# Altium schematic sheet MotorDrivers.SchDoc: MotorDrivers
size A3; Revision: V1.0; Time: 2017/5/10
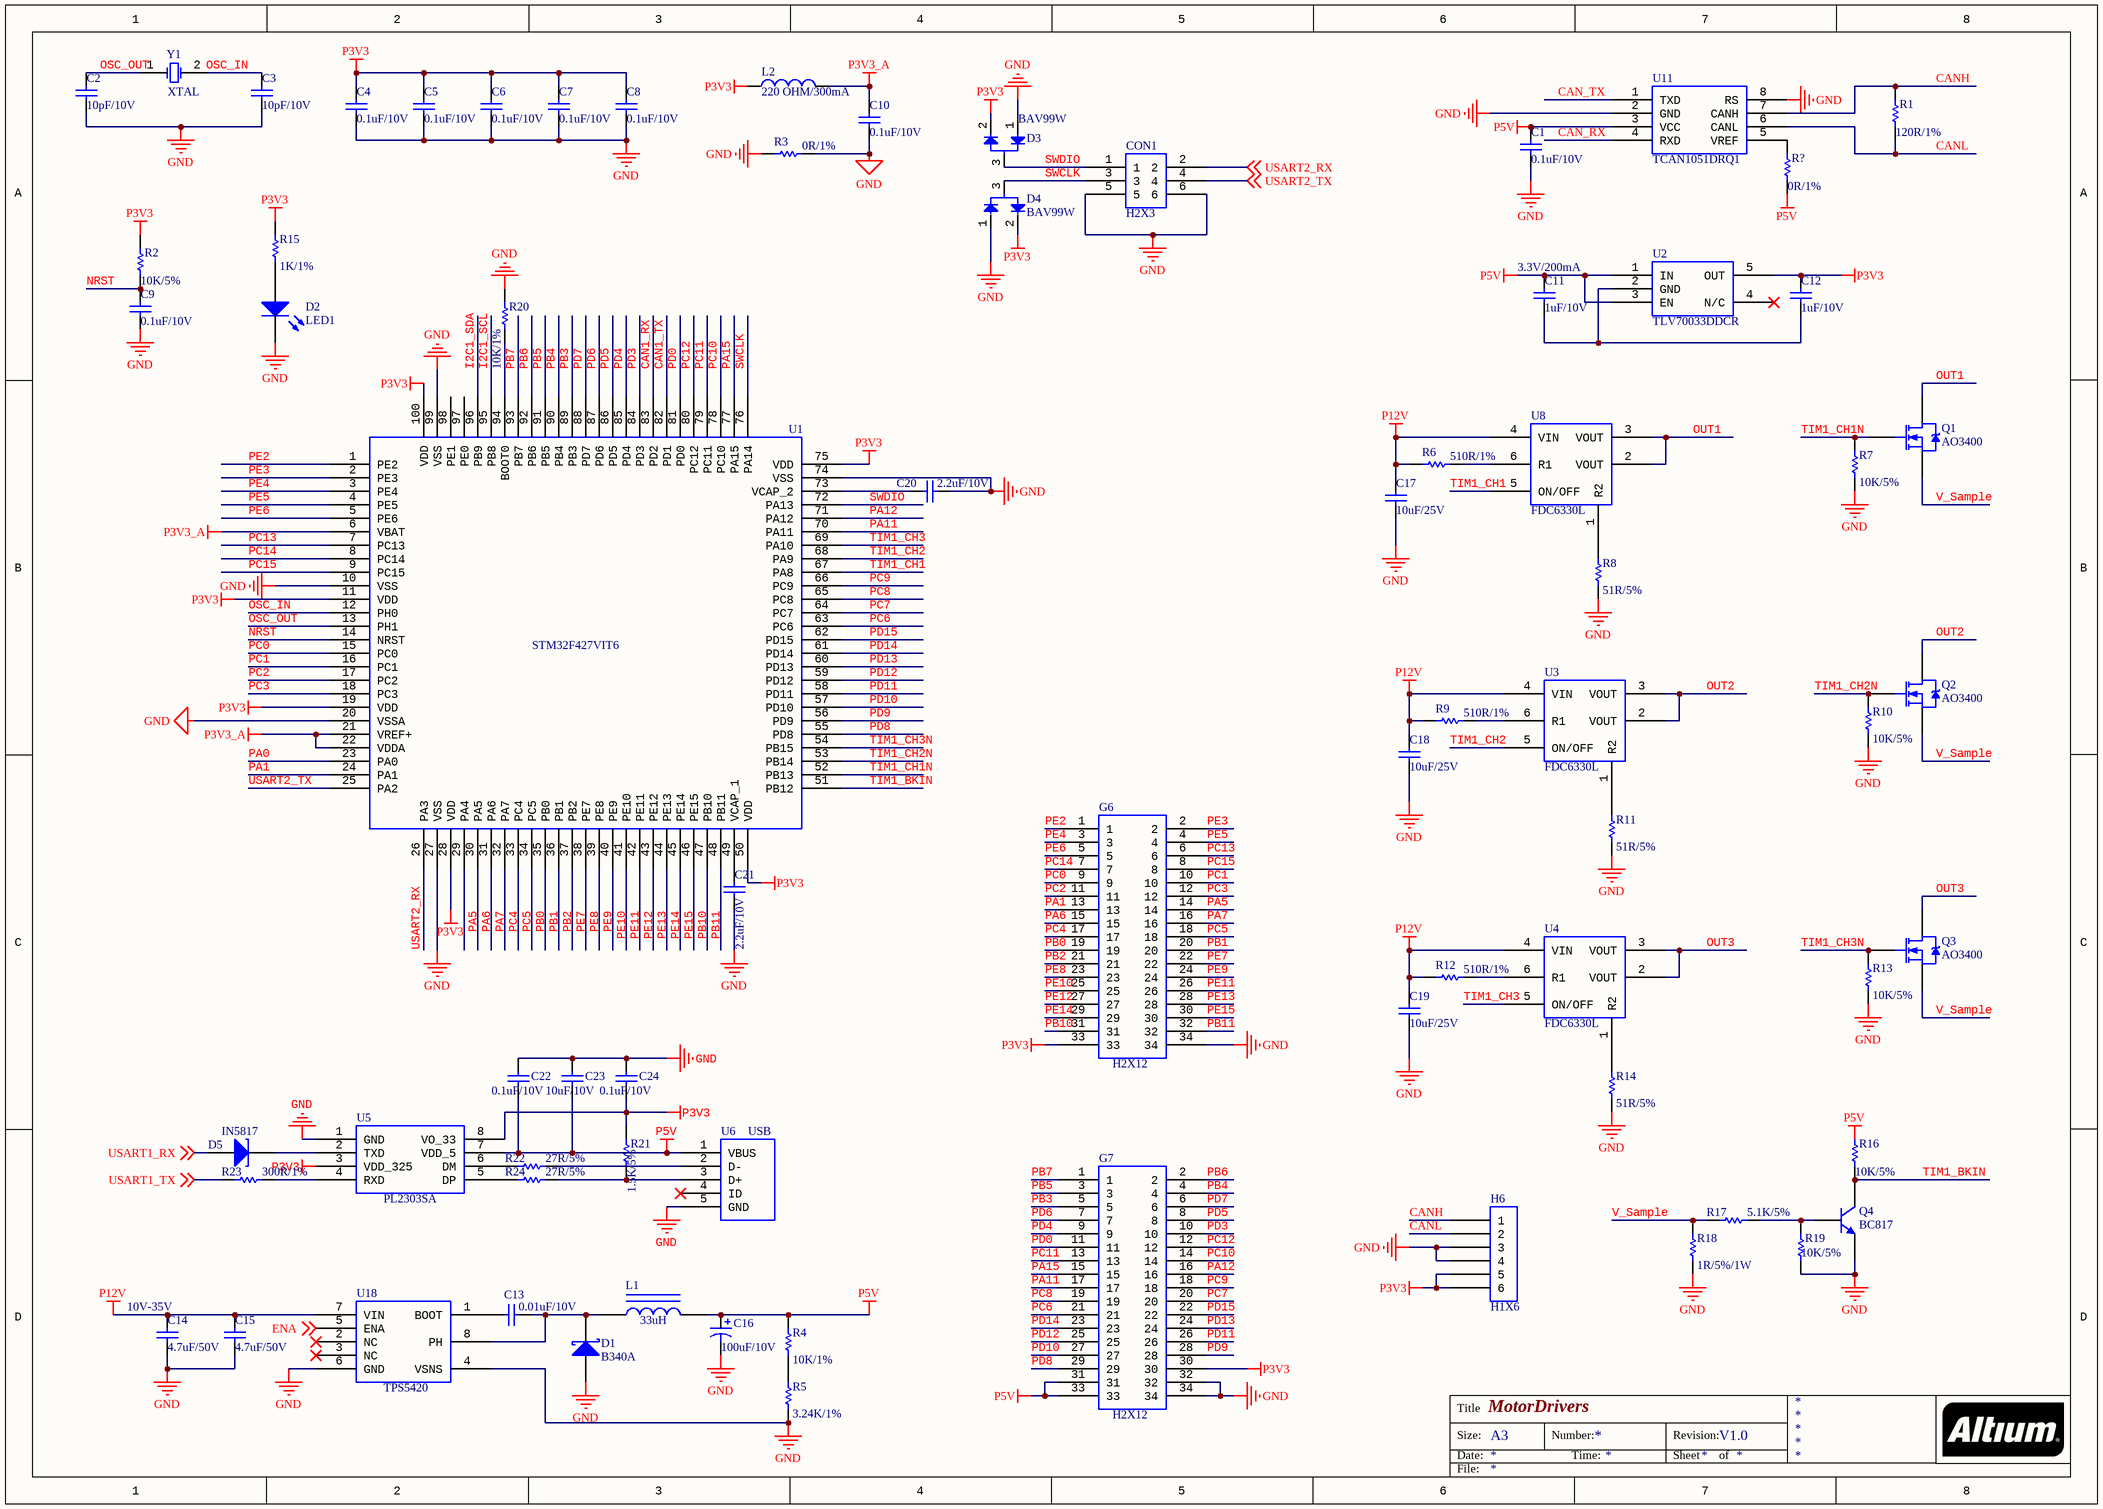
[diagram p0: MotorDrivers.SchDoc]

## Parts
C1  value 0.1uF/10V  [0805C]
C2  value 10pF/10V  [0805C]
C3  value 10pF/10V  [0805C]
C4  value 0.1uF/10V  [0805C]
C5  value 0.1uF/10V  [0805C]
C6  value 0.1uF/10V  [0805C]
C7  value 0.1uF/10V  [0805C]
C8  value 0.1uF/10V  [0805C]
C9  value 0.1uF/10V  [0805C]
C10  value 0.1uF/10V  [0805C]
C11  value 1uF/10V  [0805C]
C12  value 1uF/10V  [0805C]
C13  value 0.01uF/10V  [0805C]
C14  value 4.7uF/50V  [0805C]
C15  value 4.7uF/50V  [0805C]
C16  value 100uF/10V  [RB7.6-15]
C17  value 10uF/25V  [0805C]
C18  value 10uF/25V  [0805C]
C19  value 10uF/25V  [0805C]
C20  value 2.2uF/10V  [0805C]
C21  value 2.2uF/10V  [0805C]
C22  value 0.1uF/10V  [0805C]
C23  value 10uF/10V  [0805C]
C24  value 0.1uF/10V  [0805C]
CON1  H2X3  [H2X3]
D1  B340A  [SMB]
D2  LED1  [0805D]
D3  BAV99W  [SOT-323]
D4  BAV99W  [SOT-323]
D5  IN5817  [0805D]
G6  H2X12  [H2X17]
G7  H2X12  [H2X17]
H6  H1X6  [H1X6]
L1  value 33uH  [AXIAL-0.9]
L2  value 220 OHM/300mA  [0805l]
Q1  AO3400  [SOT-23]
Q2  AO3400  [SOT-23]
Q3  AO3400  [SOT-23]
Q4  BC817  [TO-226-AA]
R1  value 120R/1%  [0805R]
R2  value 10K/5%  [0805R]
R3  value 0R/1%  [0805R]
R4  value 10K/1%  [0805R]
R5  value 3.24K/1%  [0805R]
R6  value 510R/1%  [0805R]
R7  value 10K/5%  [0805R]
R8  value 51R/5%  [0805R]
R9  value 510R/1%  [0805R]
R10  value 10K/5%  [0805R]
R11  value 51R/5%  [0805R]
R12  value 510R/1%  [0805R]
R13  value 10K/5%  [0805R]
R14  value 51R/5%  [0805R]
R15  value 1K/1%  [0805R]
R16  value 10K/5%  [0805R]
R17  value 5.1K/5%  [0805R]
R18  value 1R/5%/1W  [0805R]
R19  value 10K/5%  [0805R]
R20  value 10K/1%  [0805R]
R21  value 1.5K/5%  [0805R]
R22  value 27R/5%  [0805R]
R23  value 300R/1%  [0805R]
R24  value 27R/5%  [0805R]
R?  value 0R/1%  [0805R]
U1  STM32F427VIT6  [STM32F427]
U2  TLV70033DDCR  [SOT-23-5]
U3  FDC6330L  [SOT-23-6]
U4  FDC6330L  [SOT-23-6]
U5  PL2303SA  [SOP-8_150mil]
U6  USB  [USB_DIP]
U8  FDC6330L  [SOT-23-6]
U11  TCAN1051DRQ1
U18  TPS5420  [SOIC-8_150MM]
Y1  XTAL  [XTAL-5.0X7.0]

## Nets
GND: C1.1 C2.1 C3.1 C4.1 C5.1 C6.1 C7.1 C8.1 C9.1 C10.1 C14.1 C15.1 C16.2 C17.1 C18.1 C19.1 C20.1 C21.1 C22.2 C23.1 C24.1 CON1.5 CON1.6 D1.1(A) D2.2(K) D3.1 D4.1 G6.34 G7.32 G7.34 H6.3 H6.4 Q4.3(E) R3.1 R3.2 R5.1 R7.2 R8.2 R10.2 R11.2 R13.2 R14.2 R18.2 R19.1 R20.1 U1.10(VSS) U1.20(VSSA) U1.27(VSS) U1.74(VSS) U1.99(VSS) U5.1(GND) U6.5(GND) U11.2(GND) U11.8(RS) U18.4(VSNS) U18.6(GND)
P3V3: C4.2 C5.2 C6.2 C7.2 C8.2 C12.2 C24.2 D3.2 D4.2 G6.33 G7.30 H6.5 H6.6 L2.1 R2.2 R15.1 R21.1 U1.11(VDD) U1.19(VDD) U1.28(VDD) U1.50(VDD) U1.75(VDD) U1.100(VDD) U2.5(OUT) U5.3(VDD_325) U5.8(VO_33)
P3V3_A: C10.2 L2.2 U1.6(VBAT) U1.21(VREF+) U1.22(VDDA)
P5V: C1.2 C11.2 C16.1 C22.1 C23.2 G7.31 G7.33 L1.2 R4.2 R?.1 U2.1(IN) U2.3(EN) U5.7(VDD_5) U6.1(VBUS) U11.3(VCC)
P12V: C14.2 C15.2 C17.2 C18.2 C19.2 R6.2 R9.2 R12.2 U3.4(VIN) U4.4(VIN) U8.4(VIN) U18.7(VIN)
CAN1_RX: U1.83(PD2)
CAN1_TX: U1.82(PD1)
CAN_RX: U11.4(RXD)
CAN_TX: U11.1(TXD)
CANH: H6.1 R1.2 U11.7(CANH)
CANL: H6.2 R1.1 U11.6(CANL)
ENA: U18.5(ENA) ; off-sheet ENA
I2C1_SCL: U1.95(PB8)
I2C1_SDA: U1.96(PB9)
NRST: C9.2 R2.1 U1.14(NRST)
OSC_IN: U1.12(PH0)
OSC_OUT: C2.2 U1.13(PH1) Y1.1(OSC1)
OUT1: Q1.2(D) U8.2(VOUT) U8.3(VOUT)
OUT2: Q2.2(D) U3.2(VOUT) U3.3(VOUT)
OUT3: Q3.2(D) U4.2(VOUT) U4.3(VOUT)
PA0: U1.23(PA0)
PA1: G6.13 U1.24(PA1)
PA5: G6.14 U1.29(PA4)
PA6: G6.15 U1.30(PA5)
PA7: G6.16 U1.31(PA6)
PA11: G7.17 U1.70(PA11)
PA12: G7.16 U1.71(PA12)
PA15: G7.15 U1.77(PA15)
PB0: G6.19 U1.34(PC5)
PB1: G6.20 U1.35(PB0)
PB2: G6.21 U1.36(PB1)
PB3: G7.5 U1.89(PB3)
PB4: G7.4 U1.90(PB4)
PB5: G7.3 U1.91(PB5)
PB6: G7.2 U1.92(PB6)
PB7: G7.1 U1.93(PB7)
PB10: G6.31 U1.46(PE15)
PB11: G6.32 U1.47(PB10)
PC0: G6.9 U1.15(PC0)
PC1: G6.10 U1.16(PC1)
PC2: G6.11 U1.17(PC2)
PC3: G6.12 U1.18(PC3)
PC4: G6.17 U1.32(PA7)
PC5: G6.18 U1.33(PC4)
PC6: G7.21 U1.63(PC6)
PC7: G7.20 U1.64(PC7)
PC8: G7.19 U1.65(PC8)
PC9: G7.18 U1.66(PC9)
PC10: G7.14 U1.78(PC10)
PC11: G7.13 U1.79(PC11)
PC12: G7.12 U1.80(PC12)
PC13: G6.6 U1.7(PC13)
PC14: G6.7 U1.8(PC14)
PC15: G6.8 U1.9(PC15)
PD0: G7.11 U1.81(PD0)
PD3: G7.10 U1.84(PD3)
PD4: G7.9 U1.85(PD4)
PD5: G7.8 U1.86(PD5)
PD6: G7.7 U1.87(PD6)
PD7: G7.6 U1.88(PD7)
PD8: G7.29 U1.55(PD8)
PD9: G7.28 U1.56(PD9)
PD10: G7.27 U1.57(PD10)
PD11: G7.26 U1.58(PD11)
PD12: G7.25 U1.59(PD12)
PD13: G7.24 U1.60(PD13)
PD14: G7.23 U1.61(PD14)
PD15: G7.22 U1.62(PD15)
PE2: G6.1 U1.1(PE2)
PE3: G6.2 U1.2(PE3)
PE4: G6.3 U1.3(PE4)
PE5: G6.4 U1.4(PE5)
PE6: G6.5 U1.5(PE6)
PE7: G6.22 U1.37(PB2)
PE8: G6.23 U1.38(PE7)
PE9: G6.24 U1.39(PE8)
PE10: G6.25 U1.40(PE9)
PE11: G6.26 U1.41(PE10)
PE12: G6.27 U1.42(PE11)
PE13: G6.28 U1.43(PE12)
PE14: G6.29 U1.44(PE13)
PE15: G6.30 U1.45(PE14)
SWCLK: CON1.3 D4.3 U1.76(PA14)
SWDIO: CON1.1 D3.3 U1.72(PA13)
TIM1_BKIN: Q4.1(C) R16.1 U1.51(PB12)
TIM1_CH1: U1.67(PA8) U8.5(ON/OFF)
TIM1_CH1N: Q1.1(G) R7.1 U1.52(PB13)
TIM1_CH2: U1.68(PA9) U3.5(ON/OFF)
TIM1_CH2N: Q2.1(G) R10.1 U1.53(PB14)
TIM1_CH3: U1.69(PA10) U4.5(ON/OFF)
TIM1_CH3N: Q3.1(G) R13.1 U1.54(PB15)
USART1_RX: D5.1(A) ; off-sheet USART1_RX
USART1_TX: R23.2 ; off-sheet USART1_TX
USART2_RX: CON1.2 U1.26(PA3) ; off-sheet USART2_RX
USART2_TX: CON1.4 U1.25(PA2) ; off-sheet USART2_TX
V_Sample: Q1.3(S) Q2.3(S) Q3.3(S) R17.1 R18.1
NetC3_2: C3.2 Y1.2(OSC2)
NetC11_1: C11.1 C12.1 U2.2(GND)
NetC13_1: C13.1 U18.1(BOOT)
NetC13_2: C13.2 D1.2(K) L1.1 U18.8(PH)
NetC20_2: C20.2 U1.73(VCAP_2)
NetC21_2: C21.2 U1.49(VCAP_1)
NetD2_1: D2.1(A) R15.2
NetD5_2: D5.2(K) U5.2(TXD)
NetQ4_2: Q4.2(B) R17.2 R19.2
NetR4_1: R4.1 R5.2
NetR6_1: R6.1 U8.6(R1)
NetR8_1: R8.1 U8.1(R2)
NetR9_1: R9.1 U3.6(R1)
NetR11_1: R11.1 U3.1(R2)
NetR12_1: R12.1 U4.6(R1)
NetR14_1: R14.1 U4.1(R2)
NetR20_2: R20.2 U1.94(BOOT0)
NetR21_2: R21.2 R24.1 U6.3(D+)
NetR22_1: R22.1 U6.2(D-)
NetR22_2: R22.2 U5.6(DM)
NetR23_1: R23.1 U5.4(RXD)
NetR24_2: R24.2 U5.5(DP)
NetR?_2: R?.2 U11.5(VREF)

Not connected (* = marked no-connect by the designer): R16 2; U1 48(PB11) 97(PE0) 98(PE1); U2 4(N/C)*; U6 4(ID)*; U18 2(NC)* 3(NC)*

## Notes on the sheet
- (near C11) 3.3V/200mA
- (near C14) 10V-35V
- Labels drawn without touching a wire or pin: OSC_IN, P5V
- Title
- Size:
- Date:
- A3
- Number:
- Time:
- Revision:
- Sheet
- of
- File:

## Library data of the parts
C1-C15 C17-C22 = Cap: Capacitor; Published: 8-Jun-2000; LatestRevisionDate: 17-Jul-2002; LatestRevisionNote: Re-released for DXP Platform.; PackageReference: RAD-0.3; Publisher: Altium Limited; PackageDescription: Radial Cap, Thru-Hole; 2 Leads; 0.3 in Pin Spacing
C16 = Cap Pol1: Polarized Capacitor (Radial); Published: 8-Jun-2000; LatestRevisionDate: 17-Jul-2002; LatestRevisionNote: Re-released for DXP Platform.; PackageReference: RB7.6-15; Publisher: Altium Limited; PackageDescription: Polarized Capacitor (Radial); 2 Leads
C23 C24 = Cap Semi: Capacitor (Semiconductor SIM Model); Published: 8-Jun-2000; LatestRevisionDate: 29-May-2009; LatestRevisionNote: IPC-7351 Footprint Added.; PackageReference: C1206; Publisher: Altium Limited; PackageDescription: Chip Capacitor
D1 = D Schottky: Schottky Diode; Published: 8-Jun-2000; LatestRevisionDate: 17-Jul-2002; LatestRevisionNote: Re-released for DXP Platform.; PackageReference: SMB; Publisher: Altium Limited; PackageDescription: DO-214-AA/SMB; 2 C-Bend Leads; Body 5.3 x 3.6 mm, inc. leads (LxW); Code_JEDEC: DO-214-AA
D2 = LED1: Typical RED GaAs LED; Published: 8-Jun-2000; LatestRevisionDate: 08-Jul-2005; LatestRevisionNote: Mech Layer 1 removed.; PackageReference: LED-1; Publisher: Altium Limited; PackageDescription: LED; 2 Leads
D3 D4 = Dual Diode: BAV99WT1G; Manufacturer: ON; Price: 0.06
D5 = D Tunnel1: Tunnel Diode - RLC Model; Published: 8-Jun-2000; LatestRevisionDate: 17-Jul-2002; LatestRevisionNote: Re-released for DXP Platform.; PackageVersion: Feb-2002; PackageReference: 3.2X1.6X1.1; Publisher: Altium Limited; PackageDescription: SM LED; 2 Flat Leads
L1 = Inductor Iron: Magnetic-Core Inductor; Published: 24-Mar-1999; LatestRevisionDate: 17-Jul-2002; LatestRevisionNote: Re-released for DXP Platform.; PackageReference: AXIAL-0.9; Publisher: Altium Limited; PackageDescription: Axial Device, Thru-Hole; 2 Leads; 0.9 in Pin Spacing
L2 = Inductor: Code_IEC: 1005; Published: 8-Jun-2000; LatestRevisionDate: 29-May-2009; LatestRevisionNote: IPC-7351 Footprint Added.; PackageReference: 0402-A; Publisher: Altium Limited; PackageDescription: Chip Inductor; Code_JEITA: 0402
Q1-Q3 = NMOS-2: N-Channel Power MOSFET; Note: Pin 2 is electrically connected to pin 4.; Published: 8-Jun-2000; LatestRevisionDate: 17-Jul-2002; LatestRevisionNote: Re-released for DXP Platform.; DatasheetVersion: PD-9.814; PackageVersion: Feb-1997; PackageReference: TO-220AB; Publisher: Altium Limited; PackageDescription: TO, Thru-Hole, Vertical, Heatsink Mounted; 3 In-Line Leads; Pitch 2.54 mm; ComponentLink1Description: Manufacturer Link; ComponentLink1URL: http://www.irf.com/
Q4 = NPN: NPN Bipolar Transistor; Published: 8-Jun-2000; LatestRevisionDate: 17-Jul-2002; LatestRevisionNote: Re-released for DXP Platform.; PackageReference: TO-226-AA; Publisher: Altium Limited; PackageDescription: TO, Flat Index; 3 In-Line, Axial Leads; Body Dia. 4.8mm; Leads 0.55 x 0.51 mm (max); Code_JEDEC: TO-226-AA
R1-R24 R? = Res1: Resistor; Published: 8-Jun-2000; LatestRevisionDate: 17-Jul-2002; LatestRevisionNote: Re-released for DXP Platform.; PackageReference: AXIAL-0.3; Publisher: Altium Limited; PackageDescription: Axial Device, Thru-Hole; 2 Leads; 0.3 in Pin Spacing
Y1 = XTAL: Crystal Oscillator; Published: 8-Jun-2000; LatestRevisionDate: 17-Jul-2002; LatestRevisionNote: Re-released for DXP Platform.; PackageReference: R38; Publisher: Altium Limited; PackageDescription: Crystal, Thru-Hole; 2 Leads; Body 3.1 x 8.2 mm (Dia.xH)